# Altium schematic sheet MIPI.SchDoc
size A; DocumentNumber: 9; SheetNumber: 9; SheetTotal: 13
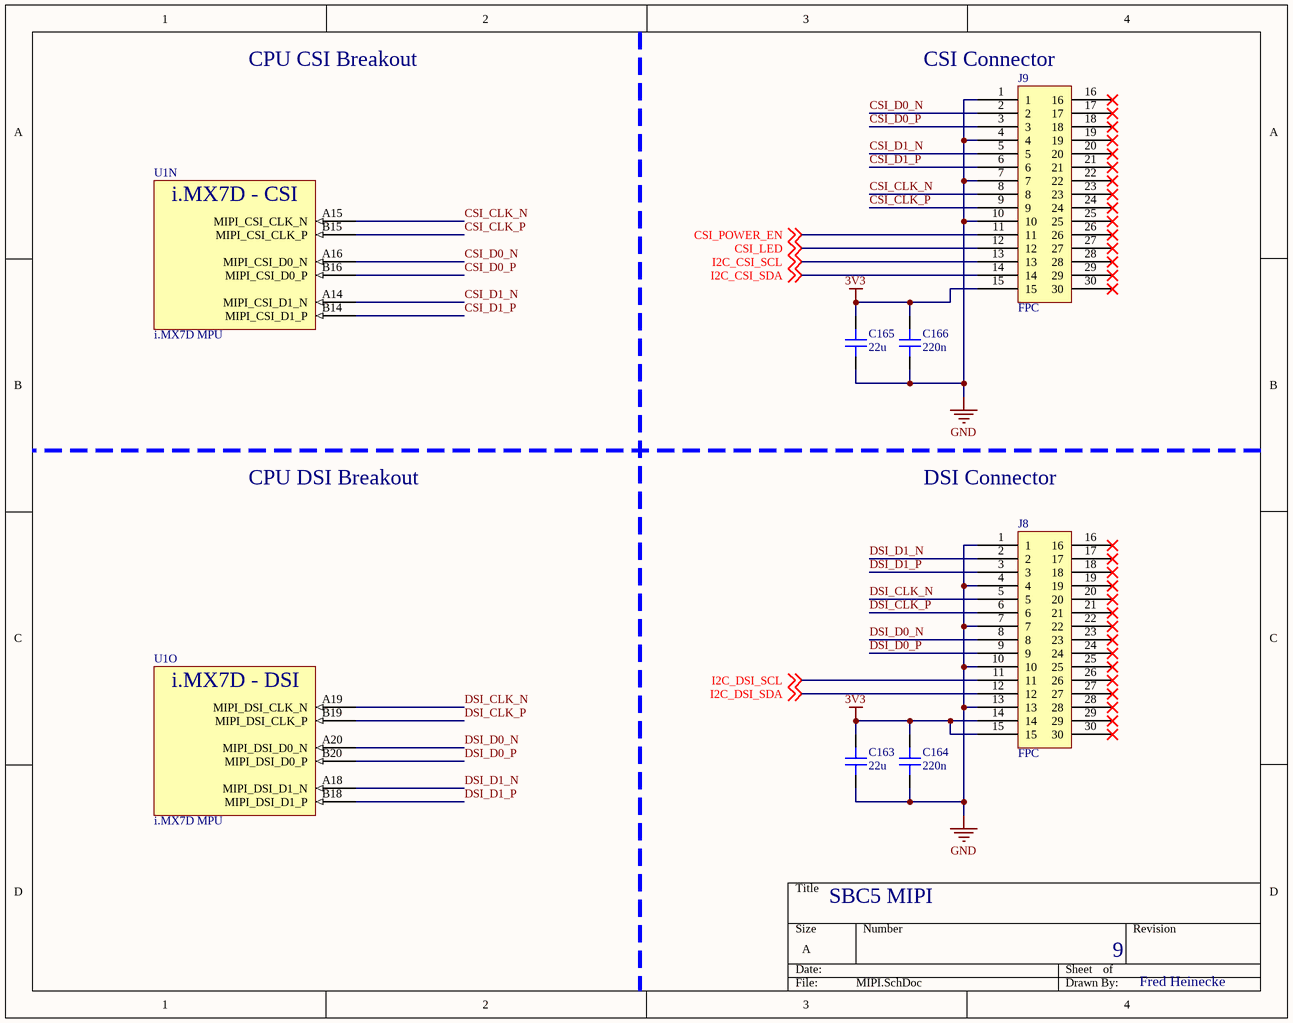
[diagram p0: MIPI.SchDoc]

## Parts
C163  22u  [C0603]
C164  220n  [C0201]
C165  22u  [C0603]
C166  220n  [C0201]
J8  FPC  [1-1734248-5]
J9  FPC  [1-1734248-5]
U1  i.MX7D MPU  [BGA541C75P25X25_1900X1900X140]  (parts N,O of 23)

## Nets
3V3: C163.2 C164.2 C165.2 C166.2 J8.14 J8.15 J9.15
GND: C163.1 C164.1 C165.1 C166.1 J8.1 J8.4 J8.7 J8.10 J8.13 J9.1 J9.4 J9.7 J9.10
CSI_CLK_N: J9.8 U1.A15(MIPI_CSI_CLK_N)
CSI_CLK_P: J9.9 U1.B15(MIPI_CSI_CLK_P)
CSI_D0_N: J9.2 U1.A16(MIPI_CSI_D0_N)
CSI_D0_P: J9.3 U1.B16(MIPI_CSI_D0_P)
CSI_D1_N: J9.5 U1.A14(MIPI_CSI_D1_N)
CSI_D1_P: J9.6 U1.B14(MIPI_CSI_D1_P)
CSI_LED: J9.12 ; off-sheet CSI_LED
CSI_POWER_EN: J9.11 ; off-sheet CSI_POWER_EN
DSI_CLK_N: J8.5 U1.A19(MIPI_DSI_CLK_N)
DSI_CLK_P: J8.6 U1.B19(MIPI_DSI_CLK_P)
DSI_D0_N: J8.8 U1.A20(MIPI_DSI_D0_N)
DSI_D0_P: J8.9 U1.B20(MIPI_DSI_D0_P)
DSI_D1_N: J8.2 U1.A18(MIPI_DSI_D1_N)
DSI_D1_P: J8.3 U1.B18(MIPI_DSI_D1_P)
I2C_CSI_SCL: J9.13 ; off-sheet I2C_CSI_SCL
I2C_CSI_SDA: J9.14 ; off-sheet I2C_CSI_SDA
I2C_DSI_SCL: J8.11 ; off-sheet I2C_DSI_SCL
I2C_DSI_SDA: J8.12 ; off-sheet I2C_DSI_SDA

Not connected (* = marked no-connect by the designer): J8 16* 17* 18* 19* 20* 21* 22* 23* 24* 25* 26* 27* 28* 29* 30*; J9 16* 17* 18* 19* 20* 21* 22* 23* 24* 25* 26* 27* 28* 29* 30*

## Notes on the sheet
- CPU CSI Breakout
- (near J9) CSI Connector
- CPU DSI Breakout
- DSI Connector
- SBC5 MIPI
- 9
- Fred Heinecke
- (in symbol MCIMX7D2DVM12SD, part N) i.MX7D - CSI
- (in symbol MCIMX7D2DVM12SD, part O) i.MX7D - DSI

## Library data of the parts
C163 C165 = GRM188R61A226ME15D: 0603 22 uF 10 V ±20% Tolerance X5R Multilayer Ceramic Chip Capacitor; Manufacturer: Murata; Capacitance: 22uF; Voltage Rating: 10V; Supplier 1: Digi-Key; Manufacturer Part Number: GRM188R61A226ME15D; RoHS: Yes; Category: Ceramic Capacitors; Stock 1: 1418007; Pricing 1: 1=0.30000, 10=0.20500, 50=0.13680, 100=0.11630, 500=0.08210, 1000=0.07184 (USD); Mount: Surface Mount; Case/Package: 0603; Case Code (Metric): 1608; Case Code (Imperial): 0603; Material: Ceramic; Weight: 0.000222oz; Min Operating Temperature: -55°C; Max Operating Temperature: 85°C; Tolerance: 20%; Packaging: Tape and Reel; Dielectric: X5R; Termination: SMD/SMT; Voltage Rating (DC): 10V; Package Quantity: 4000; Length: 1.6mm; Width: 0.8mm; Height: 0.8mm; Thickness: 0.039inch; Depth: 0.8mm; REACH SVHC: No SVHC; Lead Free: Lead Free; ComponentLink1URL: https://datasheet.ciiva.com/46444/1769893-46444975.pdf?src-supplier=Element14; ComponentLink1Description: https://datasheet.ciiva.com/46444/1769893-46444975.pdf?src-supplier=Element14; Supplier Part Number 1: 490-10476-1-ND
C164 C166 = GRM033R61C224KE14D: Cap Ceramic Monolithic 0.22uF 16VDC 10% SMD Paper T/R; Manufacturer: Murata; Supplier 1: Digi-Key; Manufacturer Part Number: GRM033R61C224KE14D; RoHS: No; Stock 1: 16192; Pricing 1: 1=0.10000, 10=0.03900, 50=0.02120, 100=0.01720, 500=0.01232, 1000=0.00968, 2500=0.00880, 5000=0.00810 (USD); ComponentLink1URL: https://search.murata.co.jp/Ceramy/image/img/A01X/G101/ENG/GRM033R61C224KE14-01.pdf?src-supplier=Digi-Key; ComponentLink1Description: https://search.murata.co.jp/Ceramy/image/img/A01X/G101/ENG/GRM033R61C224KE14-01.pdf?src-supplier=Digi-Key; Supplier Part Number 1: 490-17040-1-ND
J8 J9 = 1-1734248-5: FFC & FPC Connectors 15P 1.0 FPC, Zip V/T SMT; Manufacturer: TE Connectivity; Number of Contacts: 15; Current Rating: 1A; Voltage Rating: 125V; Gender: Receptacle; Shielding: Unshielded; Connector Type: Receptacle,Connector,Socket; Wire/Cable Type: Flat Flex; Connector System: Flex-to-Board; Mating Alignment: Yes (With); PCB Mount Alignment: No (Without); PCB Mount Retention: With; Circuit Application: Signal; Pitch: 1mm; Supplier 1: Digi-Key; Supplier Part Number 1: A101418CT-ND; Manufacturer Part Number: 1-1734248-5; RoHS: Yes; Category: FFC / FPC; Stock 1: 5987; Pricing 1: 1=0.98000, 10=0.86000, 25=0.80920, 50=0.77540, 100=0.74170, 250=0.67432, 500=0.60688 (USD); Mount: Surface Mount; Contact Plating: Gold; Contact Material: Bronze; Housing Color: Black; Housing Material: Thermoplastic; Min Operating Temperature: -4°C; Max Operating Temperature: 185°C; Number of Rows: 1; Termination: SMD/SMT; Orientation: Straight; Package Quantity: 1000; Packaging: Tape and Reel; Number of Positions: 15; Sealable: No (Without); Shrouded: Yes (With); Contact Current Rating: 1A; Length: 22.4mm; Width: 4.6mm; Height: 7.7mm; Depth: 4.6mm; ELV: Compliant; REACH SVHC: Unknown; Flammability Rating: UL94 V-0; ComponentLink1URL: https://datasheet.ciiva.com/672/eng-cd-1734248-e1-672176.pdf?src-supplier=Digi-Key; ComponentLink1Description: https://datasheet.ciiva.com/672/eng-cd-1734248-e1-672176.pdf?src-supplier=Digi-Key; ComponentLink2URL: https://datasheet.ciiva.com/672/eng-cd-1734248-e1-672177.pdf?src-supplier=Digi-Key; ComponentLink2Description: https://datasheet.ciiva.com/672/eng-cd-1734248-e1-672177.pdf?src-supplier=Digi-Key; ComponentLink3URL: https://datasheet.ciiva.com/672/eng-cd-1734248-e1-672178.pdf?src-supplier=Digi-Key; ComponentLink3Description: https://datasheet.ciiva.com/672/eng-cd-1734248-e1-672178.pdf?src-supplier=Digi-Key; ComponentLink4URL: https://datasheet.ciiva.com/7989/eng-ds-1-1773440-6-0506-7989477.pdf?src-supplier=Element14; ComponentLink4Description: https://datasheet.ciiva.com/7989/eng-ds-1-1773440-6-0506-7989477.pdf?src-supplier=Element14; ComponentLink5URL: https://datasheet.ciiva.com/16660/eng-ds-1-1773440-6-0506-16660185.pdf?src-supplier=Avnet+Europe; ComponentLink5Description: https://datasheet.ciiva.com/16660/eng-ds-1-1773440-6-0506-16660185.pdf?src-supplier=Avnet+Europe
U1 = MCIMX7D2DVM12SD: Heterogeneous Multicore Processing Architecture; Manufacturer: NXP Freescale; Manufacturer Part Number: MCIMX7D2DVM12SD; Stock 1: 0; Pricing 1: 168=18.42238 (USD); ComponentLink1Description: Datasheet; ComponentLink1URL: https://www.nxp.com/docs/en/data-sheet/IMX7DCEC.pdf; ComponentLink2Description: Reference manual; ComponentLink2URL: https://www.nxp.com/docs/en/reference-manual/IMX7DRM.pdf; ComponentLink3Description: Hardware Development Guide; ComponentLink3URL: https://www.nxp.com/docs/en/user-guide/IMX7DSHDG.pdf; Supplier 1: Digi-Key; Supplier Part Number 1: 568-15401-ND